# Altium schematic sheet Tx.SchDoc
size A; SheetNumber: 2; SheetTotal: 3; SPICEModelCacheFIXEDSUJ: <root> / <DocumentId>FIXEDSUJ</DocumentId> / </root>
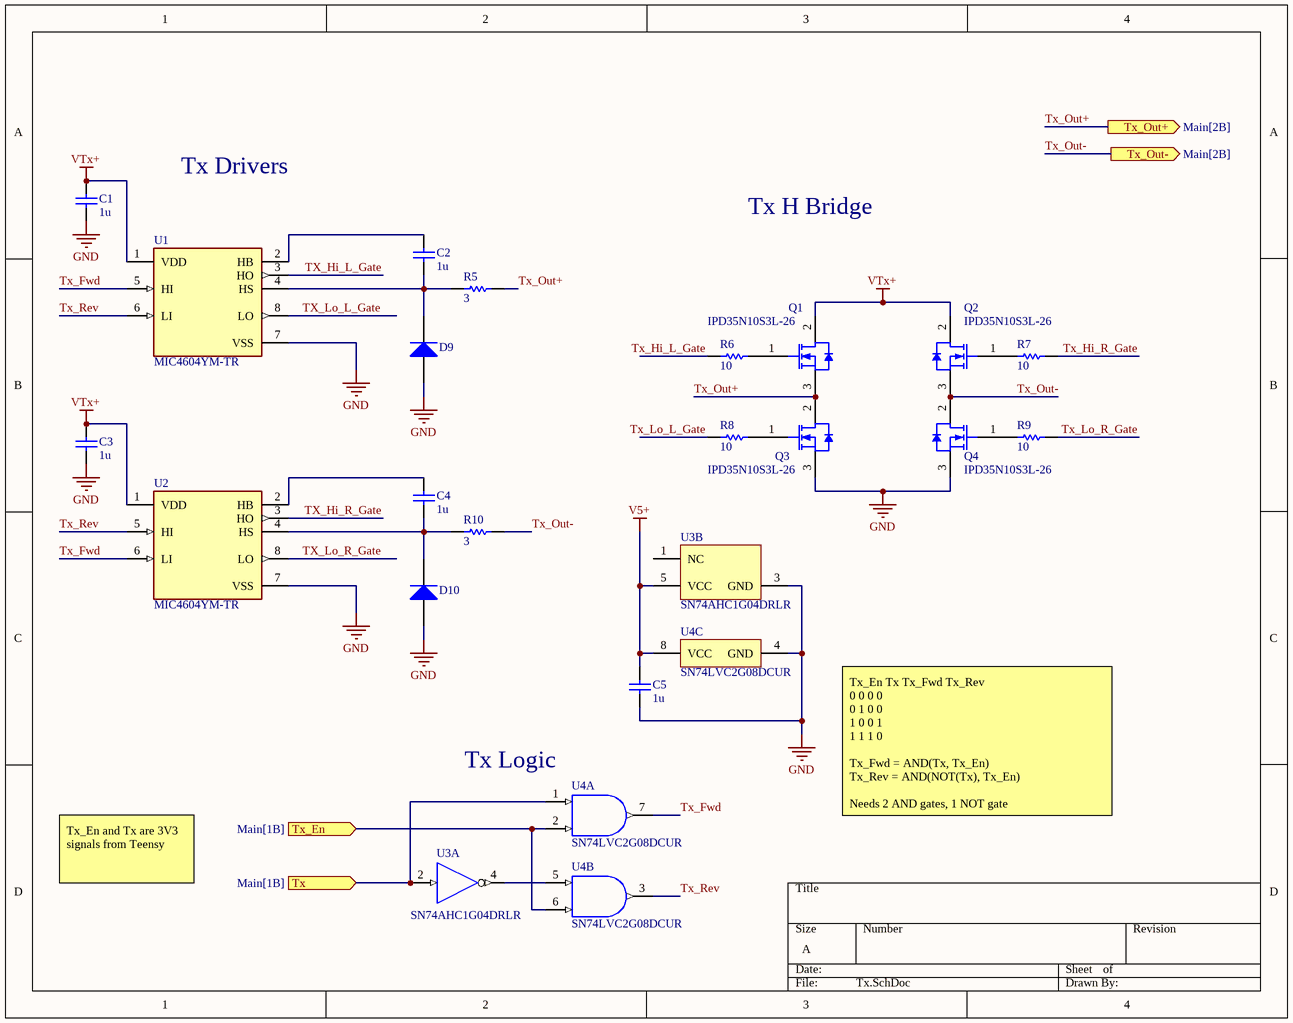
[diagram p0: Tx.SchDoc]

## Parts
C1  value 1u  [0805]  (hidden comment: Capacitor)
C2  value 1u  [0805]  (hidden comment: Capacitor)
C3  value 1u  [0805]  (hidden comment: Capacitor)
C4  value 1u  [0805]  (hidden comment: Capacitor)
C5  value 1u  [0805]  (hidden comment: Capacitor)
D9  Diode  [SOD-123F]  (value not drawn)
D10  Diode  [SOD-123F]  (value not drawn)
Q1  IPD35N10S3L-26  [INF-PG-TO252-3-11_M]
Q2  IPD35N10S3L-26  [INF-PG-TO252-3-11_M]
Q3  IPD35N10S3L-26  [INF-PG-TO252-3-11_M]
Q4  IPD35N10S3L-26  [INF-PG-TO252-3-11_M]
R5  value 3  [0805]  (hidden comment: Resistor)
R6  value 10  [0805]  (hidden comment: Resistor)
R7  value 10  [0805]  (hidden comment: Resistor)
R8  value 10  [0805]  (hidden comment: Resistor)
R9  value 10  [0805]  (hidden comment: Resistor)
R10  value 3  [0805]  (hidden comment: Resistor)
U1  MIC4604YM-TR  [FP-SOICN-8LD-PL-1-IPC_A]
U2  MIC4604YM-TR  [FP-SOICN-8LD-PL-1-IPC_A]
U3  SN74AHC1G04DRLR  [DRL0005A_M]  (parts A,B of 2)
U4  SN74LVC2G08DCUR  [DCU0008A_M]  (parts A,B,C of 3)

## Ports
Tx (in, see Main[1B]), Tx_En (in, see Main[1B]), Tx_Out+ (out, see Main[2B]), Tx_Out- (out, see Main[2B])

## Nets
GND: C1.1 C3.1 C5.1 D9.1(A) D10.1(A) Q3.3(SOURCE) Q4.3(SOURCE) U1.7(VSS) U2.7(VSS) U3.3(GND) U4.4(GND)
V5+: C5.2 U3.5(VCC) U4.8(VCC)
VTx+: C1.2 C3.2 Q1.2(DRAIN) Q2.2(DRAIN) U1.1(VDD) U2.1(VDD)
Tx: U3.2(A) U4.1(1A) ; port Tx
Tx_En: U4.2(1B) U4.6(2B) ; port Tx_En
Tx_Fwd: U1.5(HI) U2.6(LI) U4.7(1Y)
Tx_Hi_L_Gate: R6.1 U1.3(HO)
Tx_Hi_R_Gate: R7.2 U2.3(HO)
Tx_Lo_L_Gate: R8.1 U1.8(LO)
Tx_Lo_R_Gate: R9.2 U2.8(LO)
Tx_Out+: Q1.3(SOURCE) Q3.2(DRAIN) R5.2 ; port Tx_Out+
Tx_Out-: Q2.3(SOURCE) Q4.2(DRAIN) R10.2 ; port Tx_Out-
Tx_Rev: U1.6(LI) U2.5(HI) U4.3(2Y)
NetC2_1: C2.1 D9.2(K) R5.1 U1.4(HS)
NetC2_2: C2.2 U1.2(HB)
NetC4_1: C4.1 D10.2(K) R10.1 U2.4(HS)
NetC4_2: C4.2 U2.2(HB)
NetQ1_1: Q1.1(GATE) R6.2
NetQ2_1: Q2.1(GATE) R7.1
NetQ3_1: Q3.1(GATE) R8.2
NetQ4_1: Q4.1(GATE) R9.1
NetU3_4: U3.4(Y) U4.5(2A)

Not connected (* = marked no-connect by the designer): U3 1(NC)

## Notes on the sheet
- Tx Drivers
- Tx H Bridge
- (near U4) Tx Logic
- Tx_En Tx Tx_Fwd Tx_Rev
  0 0 0 0
  0 1 0 0
  1 0 0 1
  1 1 1 0
  Tx_Fwd = AND(Tx, Tx_En)
  Tx_Rev = AND(NOT(Tx), Tx_En)
  Needs 2 AND gates, 1 NOT gate
- Tx_En and Tx are 3V3 signals from Teensy

## Library data of the parts
C1-C5 = Capacitor: SimulationGenericComponent: True
D9 D10 = Diode: AF: 1; BV: 0; BV_MAX: 1e99; EG: 1.11; FC: 0.5; IBV: 0.001; ISR: 1e-14; MJSW: 0.33; NTUN: 30; TNOM: 27; XTI: 3; SimulationGenericComponent: True; CJO: 0; CJP: 0; CTA: 0; CTP: 0; FCS: 0.5; FV_MAX: 1e99; IKF: 0; IKR: 0; JSW: 0; JTUN: 0; JTUNSW: 0; KEG: 1; KF: 0; LEVEL: 1; N: 1; NBV: 1; NR: 1; NS: 1; PHP: 1; RS: 0; TCV: 0; TLEV: 0; TLEVC: 0; TM1: 0; TM2: 0; TPB: 0; TPHP: 0; TRS: 0; TRS2: 0; TT: 0; TTT1: 0; TTT2: 0; VJ: 1; XTITUN: 3; IS: 1e-14
Q1-Q4 = CMP-1138-00144-1: OptiMOS-T Power-Transistor, 100 V VDS, 35 A ID, PG-TO252-3-11, Reel, Green; Manufacturer: Infineon; VGS(th) (max): 2.4 V; ID (max): 35 A; RthJC (max): 2.1 K/W; RDS (on) (max) (@10V): 24 mOhm; VDS (max): 100 V; Green: TRUE; VGS(th) (min): 1.2 V; QG: 39 nC; RDS (on) (max) (@4.5V): 31.9 mOhm; IDpuls (max): 140 A; Ptot (max): 71 W; ComponentLink1URL: http://www.infineon.com/; ComponentLink1Description: Manufacturer URL; ComponentLink3URL: http://www.infineon.com/dgdl/BTS142_DS_13.pdf?folderId=db3a3043163797a6011667aa084c0e01&fileId=db3a3043163797a6011667ac98be0e02&location=en.Products.Automotive_ICs.Smart_High-_and_Low-Side_Switches.HITFET___TEMPFET__-_Smart_Low-Side_Switches.DATASHEET.BTS1; Packing: Reel; ComponentLink3Description: Package Specification; PackageReference: PG-TO252-3-11; ComponentLink2URL: http://www.infineon.com/dgdl/IPD35N10S3L-26_DS_1_1.pdf?folderId=db3a3043156fd5730115c7d50620107c&fileId=db3a30431a5c32f2011a9085629c594b&location=en.Products.Automotive_ICs.Automotive_MOSFETs.Single__N-Channel_100V_MOSFETs.DATASHEET.IPD35N10S3L-26_DS_1_1.p; ComponentLink2Description: Datasheet; DatasheetVersion: Rev.1.1; Mounting Technology: Surface Mount; PartNumber: IPD35N10S3L-26; PackageVersion: Dec-06; PackageDescription: 3-Pin Plastic (Green) Transistor Single Outline Package, 6.5 x 6.12 mm Body, 2.28 mm Pitch; Technology: OptiMOS-T; Halogen-free: TRUE
R5-R10 = Resistor: TC1: 0; SimulationGenericComponent: True; TC2: 0
U1 U2 = CMP-06319-000039-1: IC GATE DRVR HALF-BRIDGE 8SOIC; Min Supply Voltage: 5.5V; Max Supply Voltage: 16V; Turn-On Delay Time: 75ns; Rise Time: 20ns; Number of Drivers: 2; Operating Supply Voltage: 12V; Number of Outputs: 1; Nominal Supply Current: 48uA; Max Output Current: 1A; Channel Type: Independent; Packaging: Tape and Reel; Turn-Off Delay Time: 75ns; Number of Pins: 8; Fall Time: 20ns; Max Operating Temperature: 125°C; Min Operating Temperature: -40°C; Package Quantity: 2500; Lead Free: Lead Free; Supply Current: 48uA; Mount: Surface Mount; RoHS Compliant: Yes; Series: -; Case/Package: SOIC
U3 = CMP-0859-00797-3: Single Inverter Gate, DRL0005A, LARGE T&R; Manufacturer: Texas Instruments; VCC(Min)(V): 2; F @ Nom Voltage(Max)(Mhz): 75; VCC(Max)(V): 5.5; Output Type: CMOS; Voltage(Nom)(V): 3.3,5; Schmitt Trigger: No; Logic: Inverting; Technology Family: AHC; tpd @ Nom Voltage(Max)(ns): 10.6,7.5; Rating: Catalog; Sub-Family: Inverting Buffer/Driver; Output Drive (IOL/IOH)(Max)(mA): 50/-50; ICC @ Nom Voltage(Max)(mA): 0.01; Bits(#): 1; PackageReference: DRL0005A; Operating Temperature Range(C): -40 to 125; Input Type: CMOS; Generic Part Number: SN74AHC1G04; DatasheetVersion: SCLS318S; 3-State Output: No
U4 = CMP-0859-00670-3: Dual 2-Input Positive-AND Gate, DCU0008A, LARGE T&R; Manufacturer: Texas Instruments; Logic: True; Output Drive (IOL/IOH)(Max)(mA): 32/-32; F @ Nom Voltage(Max)(Mhz): 150; Technology Family: LVC; Rating: Catalog; tpd @ Nom Voltage(Max)(ns): 9.8,5.8,5.3,4.8; Voltage(Nom)(V): 1.8,2.5,3.3,5; Schmitt Trigger: No; Input Type: CMOS/TTL; Bits(#): 2; Gate Type: AND; VCC(Max)(V): 5.5; VCC(Min)(V): 1.65; ICC @ Nom Voltage(Max)(mA): 0.01; Output Type: CMOS; Sub-Family: AND Gate; PackageReference: DCU0008A; Operating Temperature Range(C): -40 to 125,-40 to 85; 3-State Output: No; DatasheetVersion: SCES198M; Generic Part Number: SN74LVC2G08